# Altium schematic sheet demux1-10.SchDoc
size A2
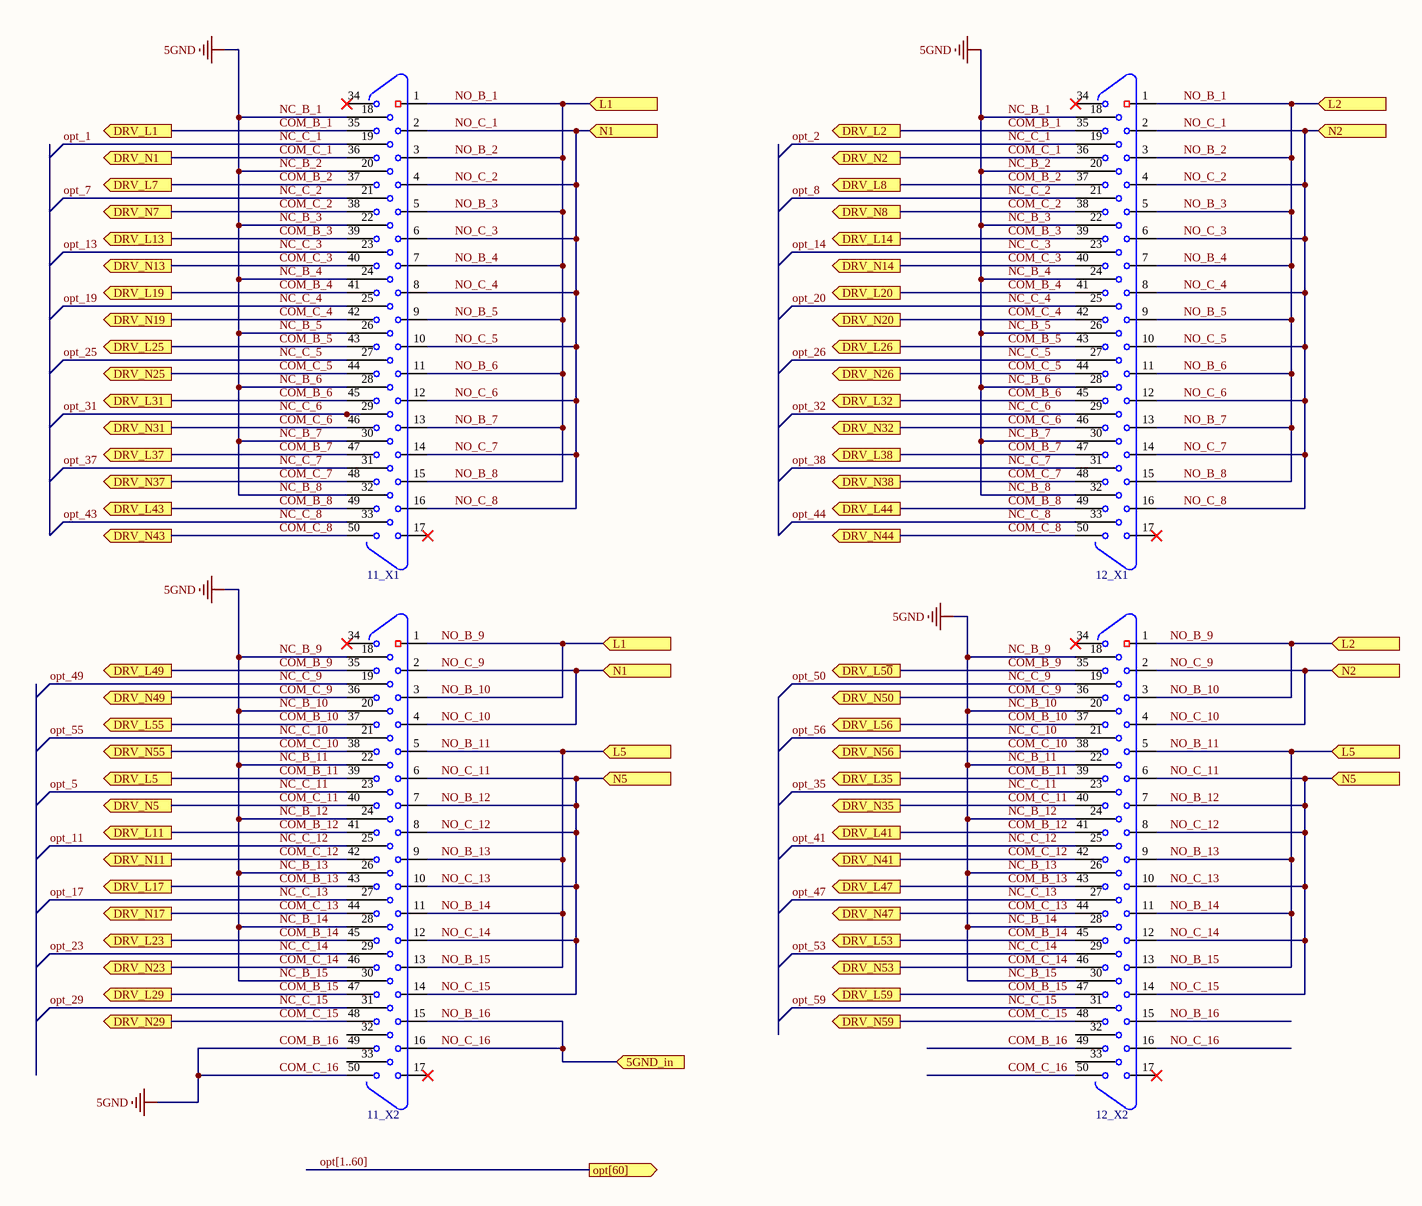
[diagram p0: demux1-10.SchDoc, left]
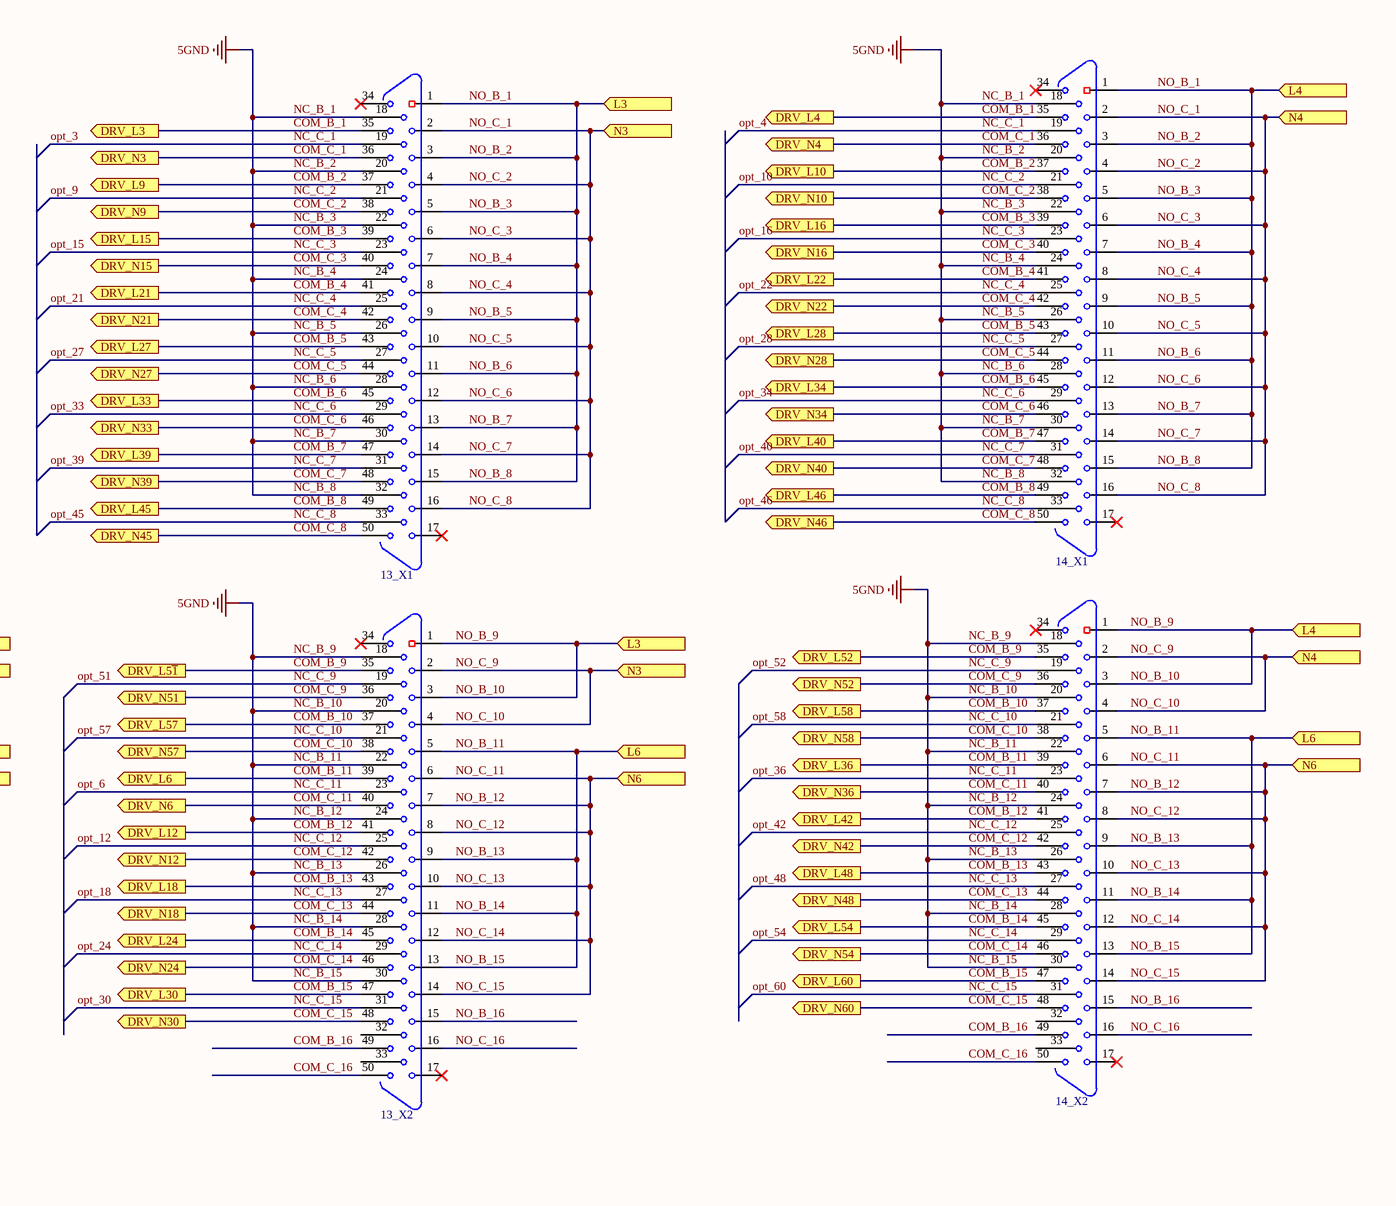
[diagram p1: demux1-10.SchDoc, right]

## Parts
11_X1  DB50  [DB50_RA]  (value not drawn)
11_X2  DB50  [DB50_RA]  (value not drawn)
12_X1  DB50  [DB50_RA]  (value not drawn)
12_X2  DB50  [DB50_RA]  (value not drawn)
13_X1  DB50  [DB50_RA]  (value not drawn)
13_X2  DB50  [DB50_RA]  (value not drawn)
14_X1  DB50  [DB50_RA]  (value not drawn)
14_X2  DB50  [DB50_RA]  (value not drawn)

## Ports
5GND_in (in), DRV_L1 (out), DRV_L2 (out), DRV_L3 (out), DRV_L4 (out), DRV_L5 (out), DRV_L5~{0} (out), DRV_L5~{1} (out), DRV_L6 (out), DRV_L7 (out), DRV_L8 (out), DRV_L9 (out), DRV_L10 (out), DRV_L11 (out), DRV_L12 (out), DRV_L13 (out), DRV_L14 (out), DRV_L15 (out), DRV_L16 (out), DRV_L17 (out), DRV_L18 (out), DRV_L19 (out), DRV_L20 (out), DRV_L21 (out), DRV_L22 (out), DRV_L23 (out), DRV_L24 (out), DRV_L25 (out), DRV_L26 (out), DRV_L27 (out), DRV_L28 (out), DRV_L29 (out), DRV_L30 (out), DRV_L31 (out), DRV_L32 (out), DRV_L33 (out), DRV_L34 (out), DRV_L35 (out), DRV_L36 (out), DRV_L37 (out), DRV_L38 (out), DRV_L39 (out), DRV_L40 (out), DRV_L41 (out), DRV_L42 (out), DRV_L43 (out), DRV_L44 (out), DRV_L45 (out), DRV_L46 (out), DRV_L47 (out), DRV_L48 (out), DRV_L49 (out), DRV_L52 (out), DRV_L53 (out), DRV_L54 (out), DRV_L55 (out), DRV_L56 (out), DRV_L57 (out), DRV_L58 (out), DRV_L59 (out), DRV_L60 (out), DRV_N1 (out), DRV_N2 (out), DRV_N3 (out), DRV_N4 (out), DRV_N5 (out), DRV_N6 (out), DRV_N7 (out), DRV_N8 (out), DRV_N9 (out), DRV_N10 (out), DRV_N11 (out), DRV_N12 (out), DRV_N13 (out), DRV_N14 (out), DRV_N15 (out), DRV_N16 (out), DRV_N17 (out), DRV_N18 (out), DRV_N19 (out), DRV_N20 (out), DRV_N21 (out), DRV_N22 (out), DRV_N23 (out), DRV_N24 (out), DRV_N25 (out), DRV_N26 (out), DRV_N27 (out), DRV_N28 (out), DRV_N29 (out), DRV_N30 (out), DRV_N31 (out), DRV_N32 (out), DRV_N33 (out), DRV_N34 (out), DRV_N35 (out), DRV_N36 (out), DRV_N37 (out), DRV_N38 (out), DRV_N39 (out), DRV_N40 (out), DRV_N41 (out), DRV_N42 (out), DRV_N43 (out), DRV_N44 (out), DRV_N45 (out), DRV_N46 (out), DRV_N47 (out), DRV_N48 (out), DRV_N49 (out), DRV_N50 (out), DRV_N51 (out), DRV_N52 (out), DRV_N53 (out), DRV_N54 (out), DRV_N55 (out), DRV_N56 (out), DRV_N57 (out), DRV_N58 (out), DRV_N59 (out), DRV_N60 (out), L1 (in), L2 (in), L3 (in), L4 (in), L5 (in), L6 (in), N1 (in), N2 (in), N3 (in), N4 (in), N5 (in), N6 (in), opt[60] (out)

## Nets
COM_B_16: 11_X1.18 11_X1.20 11_X1.22 11_X1.24 11_X1.26 11_X1.28 11_X1.30 11_X1.32 11_X2.18 11_X2.20 11_X2.22 11_X2.24 11_X2.26 11_X2.28 11_X2.30 11_X2.49 11_X2.50 12_X1.18 12_X1.20 12_X1.22 12_X1.24 12_X1.26 12_X1.28 12_X1.30 12_X1.32 12_X2.18 12_X2.20 12_X2.22 12_X2.24 12_X2.26 12_X2.28 12_X2.30 12_X2.49 12_X2.50 13_X1.18 13_X1.20 13_X1.22 13_X1.24 13_X1.26 13_X1.28 13_X1.30 13_X1.32 13_X2.18 13_X2.20 13_X2.22 13_X2.24 13_X2.26 13_X2.28 13_X2.30 13_X2.49 13_X2.50 14_X1.18 14_X1.20 14_X1.22 14_X1.24 14_X1.26 14_X1.28 14_X1.30 14_X1.32 14_X2.18 14_X2.20 14_X2.22 14_X2.24 14_X2.26 14_X2.28 14_X2.30 14_X2.49 14_X2.50  [also labelled 5GND, COM_C_16, NC_B_1, NC_B_10, NC_B_11, NC_B_12, NC_B_13, NC_B_14, NC_B_15, NC_B_2, NC_B_3, NC_B_4, NC_B_5, NC_B_6, NC_B_7, NC_B_8, NC_B_9]
COM_B_1: 11_X1.35 12_X1.35 13_X1.35 14_X1.35 ; port DRV_L1, port DRV_L2, port DRV_L3, port DRV_L4
COM_B_2: 11_X1.37 12_X1.37 13_X1.37 14_X1.37 ; port DRV_L7, port DRV_L8, port DRV_L9, port DRV_L10
COM_B_3: 11_X1.39 12_X1.39 13_X1.39 14_X1.39 ; port DRV_L13, port DRV_L14, port DRV_L15, port DRV_L16
COM_B_4: 11_X1.41 12_X1.41 13_X1.41 14_X1.41 ; port DRV_L19, port DRV_L20, port DRV_L21, port DRV_L22
COM_B_5: 11_X1.43 12_X1.43 13_X1.43 14_X1.43 ; port DRV_L25, port DRV_L26, port DRV_L27, port DRV_L28
COM_B_6: 11_X1.45 12_X1.45 13_X1.45 14_X1.45 ; port DRV_L31, port DRV_L32, port DRV_L33, port DRV_L34
COM_B_7: 11_X1.47 12_X1.47 13_X1.47 14_X1.47 ; port DRV_L37, port DRV_L38, port DRV_L39, port DRV_L40
COM_B_8: 11_X1.49 12_X1.49 13_X1.49 14_X1.49 ; port DRV_L43, port DRV_L44, port DRV_L45, port DRV_L46
COM_B_9: 11_X2.35 12_X2.35 13_X2.35 14_X2.35 ; port DRV_L49, port DRV_L5~{1}, port DRV_L5~{0}, port DRV_L52
COM_B_10: 11_X2.37 12_X2.37 13_X2.37 14_X2.37 ; port DRV_L55, port DRV_L58, port DRV_L56, port DRV_L57
COM_B_11: 11_X2.39 12_X2.39 13_X2.39 14_X2.39 ; port DRV_L5, port DRV_L6, port DRV_L35, port DRV_L36
COM_B_12: 11_X2.41 12_X2.41 13_X2.41 14_X2.41 ; port DRV_L11, port DRV_L12, port DRV_L41, port DRV_L42
COM_B_13: 11_X2.43 12_X2.43 13_X2.43 14_X2.43 ; port DRV_L17, port DRV_L18, port DRV_L47, port DRV_L48
COM_B_14: 11_X2.45 12_X2.45 13_X2.45 14_X2.45 ; port DRV_L23, port DRV_L24, port DRV_L53, port DRV_L54
COM_B_15: 11_X2.47 12_X2.47 13_X2.47 14_X2.47 ; port DRV_L29, port DRV_L30, port DRV_L59, port DRV_L60
COM_C_1: 11_X1.36 12_X1.36 13_X1.36 14_X1.36 ; port DRV_N1, port DRV_N2, port DRV_N3, port DRV_N4
COM_C_2: 11_X1.38 12_X1.38 13_X1.38 14_X1.38 ; port DRV_N7, port DRV_N8, port DRV_N9, port DRV_N10
COM_C_3: 11_X1.40 12_X1.40 13_X1.40 14_X1.40 ; port DRV_N13, port DRV_N14, port DRV_N15, port DRV_N16
COM_C_4: 11_X1.42 12_X1.42 13_X1.42 14_X1.42 ; port DRV_N19, port DRV_N20, port DRV_N21, port DRV_N22
COM_C_5: 11_X1.44 12_X1.44 13_X1.44 14_X1.44 ; port DRV_N25, port DRV_N26, port DRV_N27, port DRV_N28
COM_C_6: 11_X1.46 12_X1.46 13_X1.46 14_X1.46 ; port DRV_N31, port DRV_N32, port DRV_N33, port DRV_N34
COM_C_7: 11_X1.48 12_X1.48 13_X1.48 14_X1.48 ; port DRV_N37, port DRV_N38, port DRV_N39, port DRV_N40
COM_C_8: 11_X1.50 12_X1.50 13_X1.50 14_X1.50 ; port DRV_N43, port DRV_N44, port DRV_N45, port DRV_N46
COM_C_9: 11_X2.36 12_X2.36 13_X2.36 14_X2.36 ; port DRV_N49, port DRV_N50, port DRV_N51, port DRV_N52
COM_C_10: 11_X2.38 12_X2.38 13_X2.38 14_X2.38 ; port DRV_N55, port DRV_N56, port DRV_N57, port DRV_N58
COM_C_11: 11_X2.40 12_X2.40 13_X2.40 14_X2.40 ; port DRV_N5, port DRV_N6, port DRV_N35, port DRV_N36
COM_C_12: 11_X2.42 12_X2.42 13_X2.42 14_X2.42 ; port DRV_N11, port DRV_N12, port DRV_N41, port DRV_N42
COM_C_13: 11_X2.44 12_X2.44 13_X2.44 14_X2.44 ; port DRV_N17, port DRV_N18, port DRV_N47, port DRV_N48
COM_C_14: 11_X2.46 12_X2.46 13_X2.46 14_X2.46 ; port DRV_N23, port DRV_N24, port DRV_N53, port DRV_N54
COM_C_15: 11_X2.48 12_X2.48 13_X2.48 14_X2.48 ; port DRV_N29, port DRV_N30, port DRV_N59, port DRV_N60
NC_C_1: 11_X1.19 12_X1.19 13_X1.19 14_X1.19  [also labelled opt_1, opt_2, opt_3, opt_4]
NC_C_2: 11_X1.21 12_X1.21 13_X1.21 14_X1.21  [also labelled opt_10, opt_7, opt_8, opt_9]
NC_C_3: 11_X1.23 12_X1.23 13_X1.23 14_X1.23  [also labelled opt_13, opt_14, opt_15, opt_16]
NC_C_4: 11_X1.25 12_X1.25 13_X1.25 14_X1.25  [also labelled opt_19, opt_20, opt_21, opt_22]
NC_C_5: 11_X1.27 12_X1.27 13_X1.27 14_X1.27  [also labelled opt_25, opt_26, opt_27, opt_28]
NC_C_6: 11_X1.29 12_X1.29 13_X1.29 14_X1.29  [also labelled opt_31, opt_32, opt_33, opt_34]
NC_C_7: 11_X1.31 12_X1.31 13_X1.31 14_X1.31  [also labelled opt_37, opt_38, opt_39, opt_40]
NC_C_8: 11_X1.33 12_X1.33 13_X1.33 14_X1.33  [also labelled opt_43, opt_44, opt_45, opt_46]
NC_C_9: 11_X2.19 12_X2.19 13_X2.19 14_X2.19  [also labelled opt_49, opt_50, opt_51, opt_52]
NC_C_10: 11_X2.21 12_X2.21 13_X2.21 14_X2.21  [also labelled opt_55, opt_56, opt_57, opt_58]
NC_C_11: 11_X2.23 12_X2.23 13_X2.23 14_X2.23  [also labelled opt_35, opt_36, opt_5, opt_6]
NC_C_12: 11_X2.25 12_X2.25 13_X2.25 14_X2.25  [also labelled opt_11, opt_12, opt_41, opt_42]
NC_C_13: 11_X2.27 12_X2.27 13_X2.27 14_X2.27  [also labelled opt_17, opt_18, opt_47, opt_48]
NC_C_14: 11_X2.29 12_X2.29 13_X2.29 14_X2.29  [also labelled opt_23, opt_24, opt_53, opt_54]
NC_C_15: 11_X2.31 12_X2.31 13_X2.31 14_X2.31  [also labelled opt_29, opt_30, opt_59, opt_60]
NO_B_1: 11_X1.1 11_X1.3 11_X1.5 11_X1.7 11_X1.9 11_X1.11 11_X1.13 11_X1.15 11_X2.1 11_X2.3 12_X1.1 12_X1.3 12_X1.5 12_X1.7 12_X1.9 12_X1.11 12_X1.13 12_X1.15 12_X2.1 12_X2.3 13_X1.1 13_X1.3 13_X1.5 13_X1.7 13_X1.9 13_X1.11 13_X1.13 13_X1.15 13_X2.1 13_X2.3 14_X1.1 14_X1.3 14_X1.5 14_X1.7 14_X1.9 14_X1.11 14_X1.13 14_X1.15 14_X2.1 14_X2.3 ; port L1, port L2, port L3, port L4  [also labelled NO_B_10, NO_B_2, NO_B_3, NO_B_4, NO_B_5, NO_B_6, NO_B_7, NO_B_8, NO_B_9]
NO_B_11: 11_X2.5 11_X2.9 11_X2.11 11_X2.13 12_X2.5 12_X2.9 12_X2.11 12_X2.13 13_X2.5 13_X2.9 13_X2.11 13_X2.13 14_X2.5 14_X2.9 14_X2.11 14_X2.13 ; port L5, port L6  [also labelled NO_B_13, NO_B_14, NO_B_15]
NO_B_12: 11_X2.6 11_X2.7 11_X2.8 11_X2.10 11_X2.12 11_X2.14 12_X2.6 12_X2.7 12_X2.8 12_X2.10 12_X2.12 12_X2.14 13_X2.6 13_X2.7 13_X2.8 13_X2.10 13_X2.12 13_X2.14 14_X2.6 14_X2.7 14_X2.8 14_X2.10 14_X2.12 14_X2.14 ; port N5, port N6  [also labelled NO_C_11, NO_C_12, NO_C_13, NO_C_14, NO_C_15]
NO_B_16: 11_X2.15 11_X2.16 12_X2.15 12_X2.16 13_X2.15 13_X2.16 14_X2.15 14_X2.16 ; port 5GND_in  [also labelled NO_C_16]
NO_C_1: 11_X1.2 11_X1.4 11_X1.6 11_X1.8 11_X1.10 11_X1.12 11_X1.14 11_X1.16 11_X2.2 11_X2.4 12_X1.2 12_X1.4 12_X1.6 12_X1.8 12_X1.10 12_X1.12 12_X1.14 12_X1.16 12_X2.2 12_X2.4 13_X1.2 13_X1.4 13_X1.6 13_X1.8 13_X1.10 13_X1.12 13_X1.14 13_X1.16 13_X2.2 13_X2.4 14_X1.2 14_X1.4 14_X1.6 14_X1.8 14_X1.10 14_X1.12 14_X1.14 14_X1.16 14_X2.2 14_X2.4 ; port N1, port N2, port N3, port N4  [also labelled NO_C_10, NO_C_2, NO_C_3, NO_C_4, NO_C_5, NO_C_6, NO_C_7, NO_C_8, NO_C_9]

Not connected (* = marked no-connect by the designer): 11_X1 17* 34*; 11_X2 17* 32 33 34*; 12_X1 17* 34*; 12_X2 17* 32 33 34*; 13_X1 17* 34*; 13_X2 17* 32 33 34*; 14_X1 17* 34*; 14_X2 17* 32 33 34*

## Buses and harness runs
bus opt[1..60] = port opt[60]